# Altium project UF_Servo.PrjPcb (part 4 of 8)

## Sheet Cap_Array_100p_16u.SchDoc: Adjustable Capacitor Bank
size A3; Author: M.Beldyga; CompanyName: WUT ISE; DrawnBy: M.Beldyga; Organization: WUT ISE; Address1: PW ISE; Address2: Nowowiejska 15/19 00-665 Warsaw; Address3: micbeldyga@gmail.com; SheetNumber: 4; SheetTotal: 11; ModifiedBy: -; CheckedDate: -; Title2: 10pF-16uF; DivGrp: WUT ISE; Designer: M.Beldyga; ModifiedDate: -; ProjectName: Sensor Box
Used 2 times, as channels U_PID/U_Cap_Array_100p_16u, U_PID/U_Cap_Array_100p_16u. Parts and nets are listed once, with the designators drawn on the sheet.
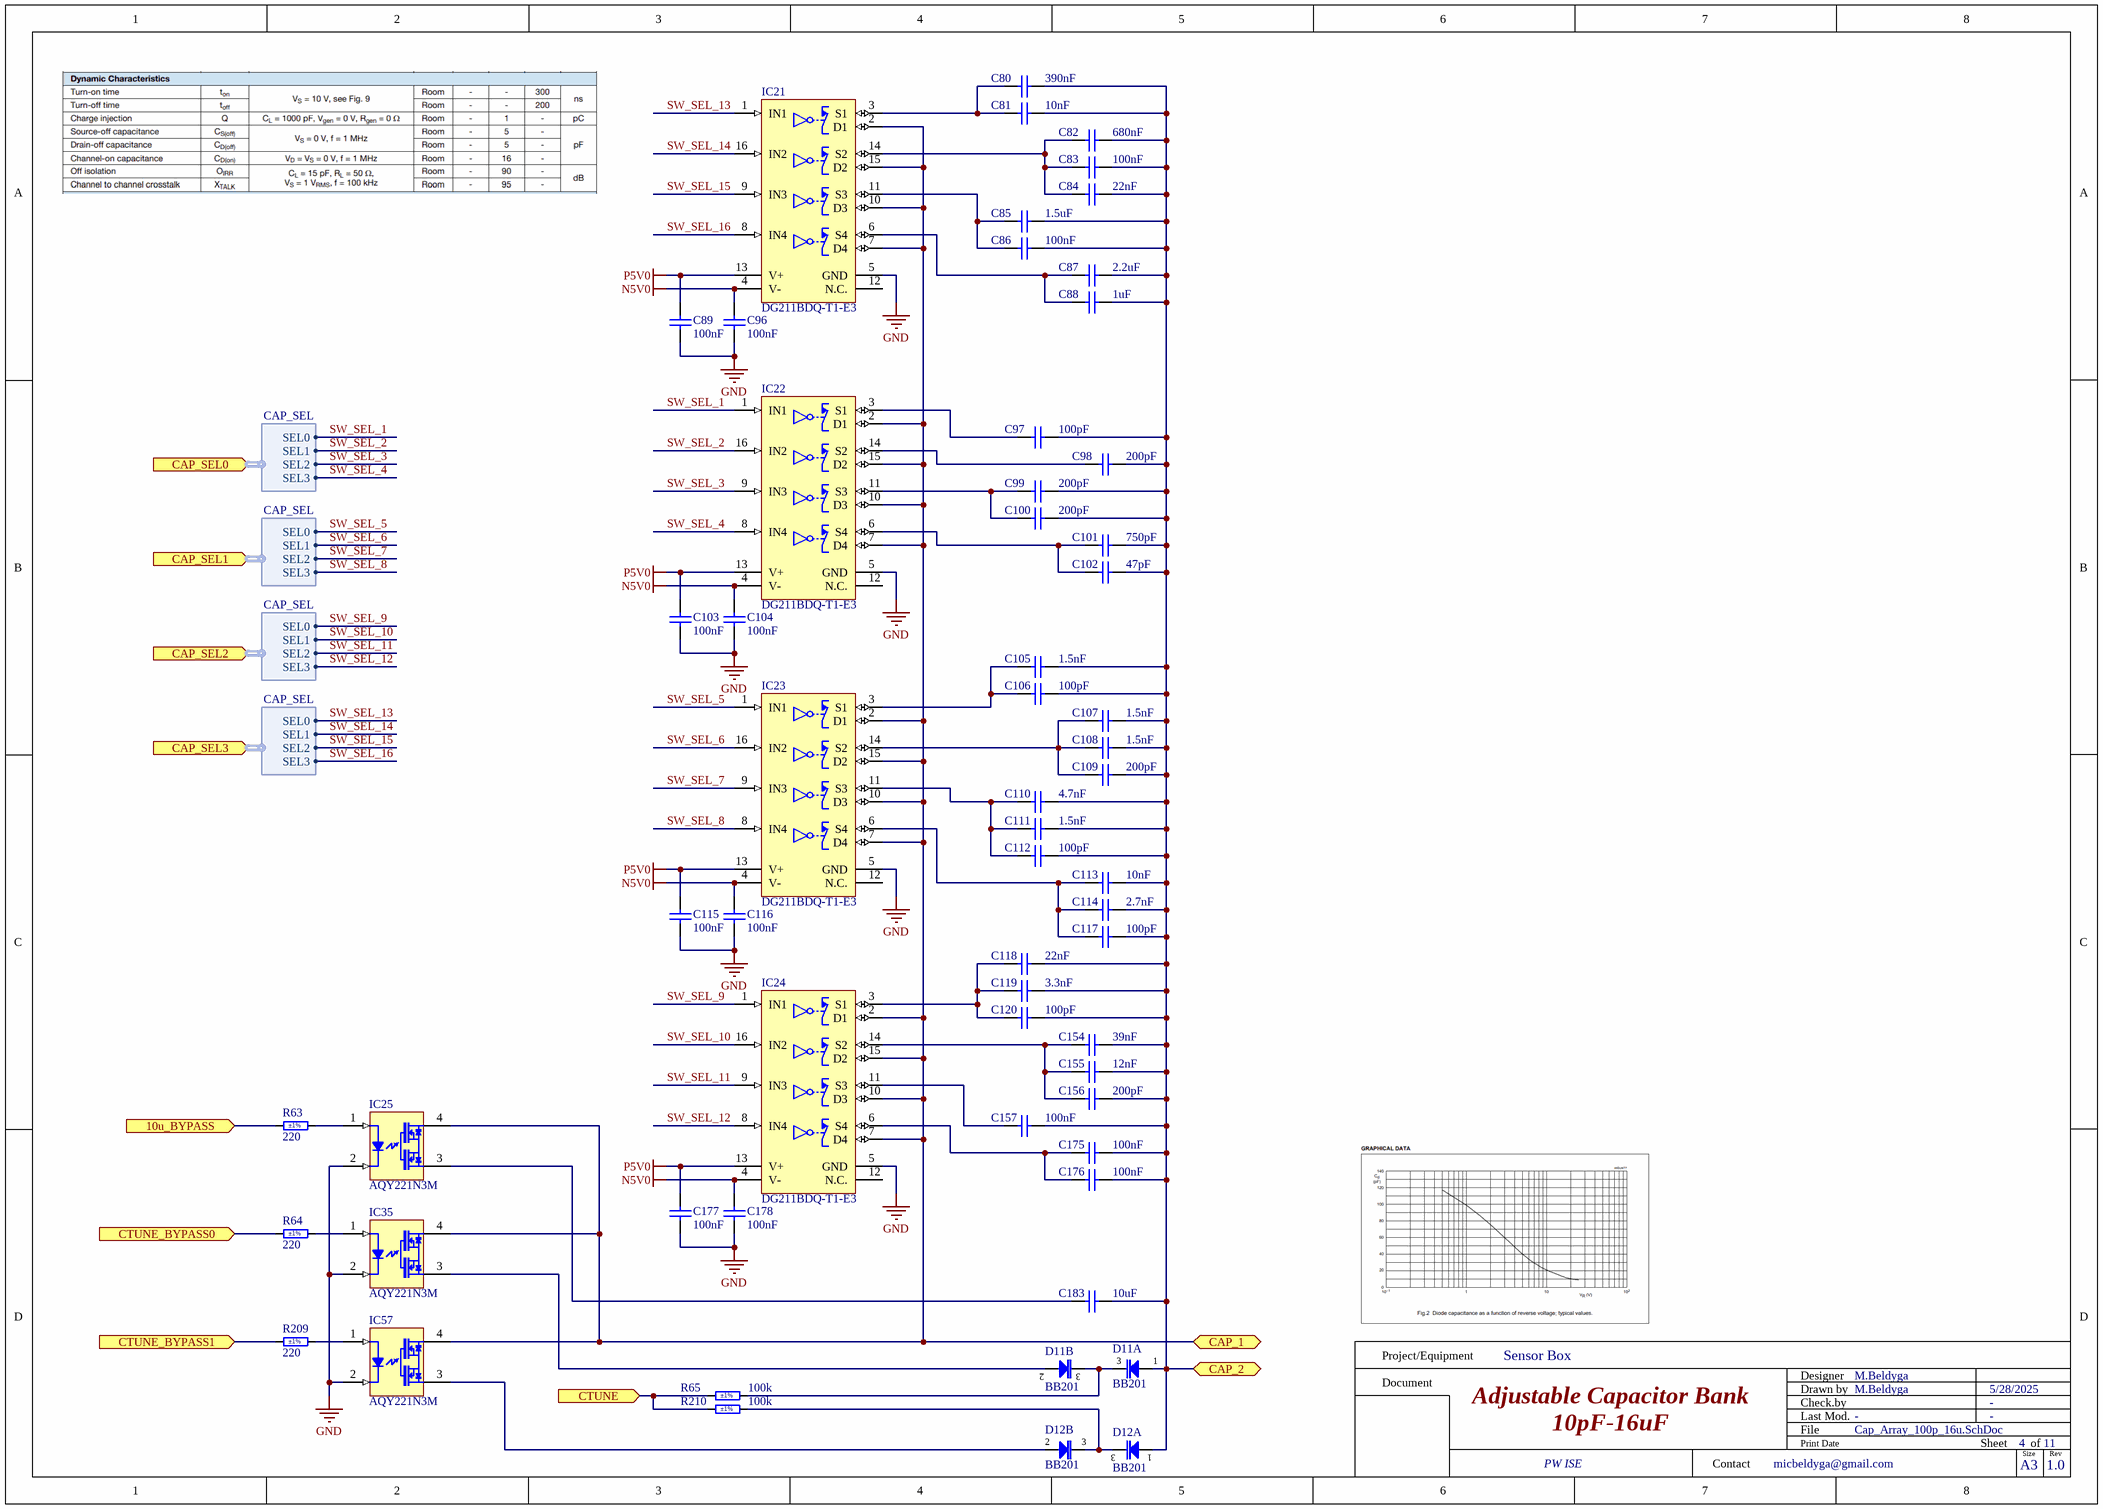
[diagram p4: Cap_Array_100p_16u.SchDoc]

### Parts
C80  390nF  [CAPC1608X90N]
C81  10nF  [CAPC1005X55N]
C82  680nF  [CAPC1608X90N]
C83  100nF  [CAPC1005X55N]
C84  22nF  [CAPC1005X55N]
C85  1.5uF  [CAPC2012X95N]
C86  100nF  [CAPC1005X55N]
C87  2.2uF  [CAPC2012X95N]
C88  1uF  [CAPC1608X90N]
C89  100nF  [CAPC1005X55N]
C96  100nF  [CAPC1005X55N]
C97  100pF  [CAPC1005X55N]
C98  200pF  [CAPC1005X55N]
C99  200pF  [CAPC1005X55N]
C100  200pF  [CAPC1005X55N]
C101  750pF  [CAPC1005X55N]
C102  47pF  [CAPC1005X55N]
C103  100nF  [CAPC1005X55N]
C104  100nF  [CAPC1005X55N]
C105  1.5nF  [CAPC1005X55N]
C106  100pF  [CAPC1005X55N]
C107  1.5nF  [CAPC1005X55N]
C108  1.5nF  [CAPC1005X55N]
C109  200pF  [CAPC1005X55N]
C110  4.7nF  [CAPC1608X90N]
C111  1.5nF  [CAPC1005X55N]
C112  100pF  [CAPC1005X55N]
C113  10nF  [CAPC1608X90N]
C114  2.7nF  [CAPC1608X90N]
C115  100nF  [CAPC1005X55N]
C116  100nF  [CAPC1005X55N]
C117  100pF  [CAPC1005X55N]
C118  22nF  [CAPC2012X95N]
C119  3.3nF  [CAPC1608X90N]
C120  100pF  [CAPC1005X55N]
C154  39nF  [CAPC2012X95N]
C155  12nF  [CAPC1608X90N]
C156  200pF  [CAPC1005X55N]
C157  100nF  [CAPC1810X06N]
C175  100nF  [CAPC1810X06N]
C176  100nF  [CAPC1810X06N]
C177  100nF  [CAPC1005X55N]
C178  100nF  [CAPC1005X55N]
C183  10uF  [CAPC2012X95N]
D11  BB201  [SOT95P230X110-3N]  (parts A,B of 2)
D12  BB201  [SOT95P230X110-3N]  (parts A,B of 2)
IC21  DG211BDQ-T1-E3  [SOP65P640X120-16N]
IC22  DG211BDQ-T1-E3  [SOP65P640X120-16N]
IC23  DG211BDQ-T1-E3  [SOP65P640X120-16N]
IC24  DG211BDQ-T1-E3  [SOP65P640X120-16N]
IC25  AQY221N3M  [PANASONIC_AQY22(SON)]
IC35  AQY221N3M  [PANASONIC_AQY22(SON)]
IC57  AQY221N3M  [PANASONIC_AQY22(SON)]
R63  220  Tolerance: ±1%  [RESC1005X40N]
R64  220  Tolerance: ±1%  [RESC1005X40N]
R65  100k  Tolerance: ±1%  [RESC1005X40N]
R209  220  Tolerance: ±1%  [RESC1005X40N]
R210  100k  Tolerance: ±1%  [RESC1005X40N]

### Ports
10u_BYPASS (in), CAP_1 (bidir), CAP_2 (bidir), CAP_SEL0 (in, harness CAP_SEL), CAP_SEL1 (in, harness CAP_SEL), CAP_SEL2 (in, harness CAP_SEL), CAP_SEL3 (in, harness CAP_SEL), CTUNE (in), CTUNE_BYPASS0 (in), CTUNE_BYPASS1 (in)

### Harnesses
CAP_SEL: SEL0, SEL1, SEL2, SEL3

### Nets
GND: C89.1 C96.1 C103.1 C104.1 C115.1 C116.1 C177.1 C178.1 IC21.5(GND) IC22.5(GND) IC23.5(GND) IC24.5(GND) IC25.2(K) IC35.2(K) IC57.2(K)
N5V0: C96.2 C104.2 C116.2 C178.2 IC21.4(V-) IC22.4(V-) IC23.4(V-) IC24.4(V-)
P5V0: C89.2 C103.2 C115.2 C177.2 IC21.13(V+) IC22.13(V+) IC23.13(V+) IC24.13(V+)
10u_BYPASS: R63.1 ; port 10u_BYPASS
CAP_1: IC21.2(D1) IC21.7(D4) IC21.10(D3) IC21.15(D2) IC22.2(D1) IC22.7(D4) IC22.10(D3) IC22.15(D2) IC23.2(D1) IC23.7(D4) IC23.10(D3) IC23.15(D2) IC24.2(D1) IC24.7(D4) IC24.10(D3) IC24.15(D2) IC25.4(E) IC35.4(E) IC57.4(E) ; port CAP_1
CAP_2: C80.1 C81.2 C82.1 C83.1 C84.2 C85.1 C86.1 C87.1 C88.1 C97.2 C98.1 C99.1 C100.1 C101.1 C102.2 C105.1 C106.2 C107.1 C108.1 C109.1 C110.1 C111.1 C112.2 C113.1 C114.1 C117.2 C118.1 C119.1 C120.2 C154.1 C155.1 C156.1 C157.1 C175.1 C176.1 C183.1 D11.1(A) D12.1(A) ; port CAP_2
CTUNE: R65.2 R210.2 ; port CTUNE
CTUNE_BYPASS0: R64.1 ; port CTUNE_BYPASS0
CTUNE_BYPASS1: R209.1 ; port CTUNE_BYPASS1
SW_SEL_1: IC22.1(IN1) ; port CAP_SEL0.SEL0
SW_SEL_2: IC22.16(IN2) ; port CAP_SEL0.SEL1
SW_SEL_3: IC22.9(IN3) ; port CAP_SEL0.SEL2
SW_SEL_4: IC22.8(IN4) ; port CAP_SEL0.SEL3
SW_SEL_5: IC23.1(IN1) ; port CAP_SEL1.SEL0
SW_SEL_6: IC23.16(IN2) ; port CAP_SEL1.SEL1
SW_SEL_7: IC23.9(IN3) ; port CAP_SEL1.SEL2
SW_SEL_8: IC23.8(IN4) ; port CAP_SEL1.SEL3
SW_SEL_9: IC24.1(IN1) ; port CAP_SEL2.SEL0
SW_SEL_10: IC24.16(IN2) ; port CAP_SEL2.SEL1
SW_SEL_11: IC24.9(IN3) ; port CAP_SEL2.SEL2
SW_SEL_12: IC24.8(IN4) ; port CAP_SEL2.SEL3
SW_SEL_13: IC21.1(IN1) ; port CAP_SEL3.SEL0
SW_SEL_14: IC21.16(IN2) ; port CAP_SEL3.SEL1
SW_SEL_15: IC21.9(IN3) ; port CAP_SEL3.SEL2
SW_SEL_16: IC21.8(IN4) ; port CAP_SEL3.SEL3
NetC80_2: C80.2 C81.1 IC21.3(S1)
NetC82_2: C82.2 C83.2 C84.1 IC21.14(S2)
NetC85_2: C85.2 C86.2 IC21.11(S3)
NetC87_2: C87.2 C88.2 IC21.6(S4)
NetC97_1: C97.1 IC22.3(S1)
NetC98_2: C98.2 IC22.14(S2)
NetC99_2: C99.2 C100.2 IC22.11(S3)
NetC101_2: C101.2 C102.1 IC22.6(S4)
NetC105_2: C105.2 C106.1 IC23.3(S1)
NetC107_2: C107.2 C108.2 C109.2 IC23.14(S2)
NetC110_2: C110.2 C111.2 C112.1 IC23.11(S3)
NetC113_2: C113.2 C114.2 C117.1 IC23.6(S4)
NetC118_2: C118.2 C119.2 C120.1 IC24.3(S1)
NetC154_2: C154.2 C155.2 C156.2 IC24.14(S2)
NetC157_2: C157.2 IC24.11(S3)
NetC175_2: C175.2 C176.2 IC24.6(S4)
NetC183_2: C183.2 IC25.3(C)
NetD11_2: D11.2(A) IC35.3(C)
NetD11_3: D11.3(COMC) R65.1
NetD12_2: D12.2(A) IC57.3(C)
NetD12_3: D12.3(COMC) R210.1
NetIC25_1: IC25.1(A) R63.2
NetIC35_1: IC35.1(A) R64.2
NetIC57_1: IC57.1(A) R209.2

Not connected (* = marked no-connect by the designer): IC21 12(N.C.); IC22 12(N.C.); IC23 12(N.C.); IC24 12(N.C.)

### Channels
U_PID/U_Cap_Array_100p_16u: designators end in B; ports 10u_BYPASS=EXP0_P14 CAP_1=NetIC21B_2 CAP_2=NetC10B_2 CTUNE=DAC_VOUT4 CTUNE_BYPASS0=EXP0_P9 CTUNE_BYPASS1=EXP0_P4
U_PID/U_Cap_Array_100p_16u: designators end in A; ports 10u_BYPASS=EXP3_P21 CAP_1=NetIC21A_2 CAP_2=NetC10A_2 CTUNE=DAC_VOUT11 CTUNE_BYPASS0=EXP3_P20 CTUNE_BYPASS1=EXP3_P19

### Notes on the sheet
- Project/Equipment
- Document
- Designer
- Drawn by
- Check.by
- Contact
- File
- Last Mod.
- Print Date
- Sheet
- Size
- A3
- of
- Rev

### Library data of the parts
C80 = 0603 390nF 16V: Cap Ceramic 0.39uF 16V X7R 5% Pad SMD 0603 125C T/R; Manufacturer: KEMET; Manufacturer Part Number: C0603C394J4RACTU; Temperature Coefficient: 30ppm/°C; Supplier: Mouser; Supplier Part Number: 80-C0603C394J4R; RoHS: Yes; Category: Ceramic Capacitors; Stock: 11668; Pricing: 1=0.36, 10=0.213, 50=0.213, 100=0.14, 1000=0.102, 10000=0.077 (USD); Case/Package: 0603; Dielectric Material: Ceramic; Material: Ceramic; Case Code (Imperial): 0603; Case Code (Metric): 1608; Min Operating Temperature: -55°C; Max Operating Temperature: 125°C; Value: 390nF; Tolerance: 5%; Voltage Rating: 16V; Voltage Rating (DC): 16V; Termination: SMD/SMT; Packaging: Tape and Reel; Package Quantity: 4000; Series: C0603C; Height: 870um; RoHS Compliant: Yes; ComponentLink1URL: http://www.mouser.com/ds/2/212/KEM_C1002_X7R_SMD-1102033.pdf?src-supplier=Mouser; ComponentLink1Description: http://www.mouser.com/ds/2/212/KEM_C1002_X7R_SMD-1102033.pdf?src-supplier=Mouser; ComponentLink2URL: https://datasheet.octopart.com/C0603C394J4RACTU-KEMET-datasheet-130256537.pdf?src-supplier=Farnell; ComponentLink2Description: https://datasheet.octopart.com/C0603C394J4RACTU-KEMET-datasheet-130256537.pdf?src-supplier=Farnell; ComponentLink3URL: https://datasheet.octopart.com/C0603C394J4RACTU-KEMET-datasheet-175422952.pdf?src-supplier=Newark; ComponentLink3Description: https://datasheet.octopart.com/C0603C394J4RACTU-KEMET-datasheet-175422952.pdf?src-supplier=Newark; ComponentLink4URL: https://datasheet.octopart.com/C0603C394J4RACTU-KEMET-datasheet-157246124.pdf?src-supplier=Electro+Sonic; ComponentLink4Description: https://datasheet.octopart.com/C0603C394J4RACTU-KEMET-datasheet-157246124.pdf?src-supplier=Electro+Sonic
C81 = CC0402_10NF_16V_10%_X7R: Non-polarised capacitor; Part Description: SMD Multilayer Chip Ceramic Capacitor; Manufacturer: GENERIC; Manufacturer1 Part Number: 223878715636; Voltage: 16V; TC: X7R; Tolerance: ±10%; Part Number: CC0402_10NF_16V_10%_X7R; Component Kind: Standard; Component Type: Standard; Pin Count: 2; Value: 10nF; Status: Not Recommended; Manufacturer Part Number: CC0402_10NF_16V_10%_X7R; Case: 0402; Mounted: Yes; Socket: No; SMD: Yes; Sense: No; Manufacturer1 Example: PHYCOMP; Manufacturer1 ComponentHeight: 0.55mm; HelpURL: \\cern.ch\dfs\Applications\Altium\Datasheets\CC0402_X7R_PHYCOMP.pdf; Author: CERN DEM JLC; CreateDate: 12/3/2007; LatestRevisionDate: 12/3/2007
C82 = 0603 680nF 16V: Surface Mount Ceramic Multilayer Capacitor 0.68uF 5% X7R 16V 0603 Paper T/R; Manufacturer: Yageo; Manufacturer Part Number: CC0603JRX7R7BB684; Supplier: Digikey; Supplier Part Number: 13-CC0603JRX7R7BB684CT-ND; RoHS: No; Category: Ceramic Capacitors; Stock: 8893; Pricing: 1=0.15, 10=0.086, 100=0.0527, 1000=0.03562 (USD); Case/Package: 0603; Value: 680nF; Dielectric: X7R; Voltage Rating (DC): 16V; Halogen Free: Halogen Free; Lead Free: Lead Free
C83 C86 C89 C96 C103 C104 C115 C116 C177 C178 = CC0402_100NF_50V_10%_X7R: as C4 on sheet PID; Part Number: CC0402_100NF_50V_10%_X7R; Component Kind: Standard; Component Type: Standard; Pin Count: 2; Value: 100nF; Status: None; Manufacturer Part Number: CC0402_100NF_50V_10%_X7R; Case: 0402; Mounted: Yes; Socket: No; SMD: Yes; Sense: No; Manufacturer1 Example: MURATA; Manufacturer1 ComponentHeight: 0.55mm; HelpURL: \\cern.ch\dfs\Applications\Altium\Datasheets\CC0402_MURATA_GRM155R71H104KE14D.pdf; Author: CERN DEM MR; CreateDate: 6/30/2017; LatestRevisionDate: 6/30/2017
C84 = CC0402_22NF_50V_5%_X7R: Non-polarised capacitor; Part Description: SMD Multilayer Chip Ceramic Capacitor; Manufacturer: GENERIC; Manufacturer1 Part Number: C0402C223J5RAC; Voltage: 50V; TC: X7R; Tolerance: ±5%; Part Number: CC0402_22NF_50V_5%_X7R; Component Kind: Standard; Component Type: Standard; Pin Count: 2; Value: 22nF; Status: Preferred; Manufacturer Part Number: CC0402_22NF_50V_5%_X7R; Case: 0402; Mounted: Yes; Socket: No; SMD: Yes; Sense: No; Manufacturer1 Example: KEMET; Manufacturer1 ComponentHeight: 0.55mm; HelpURL: \\cern.ch\dfs\Applications\Altium\Datasheets\CC0402_X7R_KEMET.pdf; Author: CERN DEM BC; CreateDate: 7/15/2020; LatestRevisionDate: 7/15/2020
C85 = 0805 1.5uF 16V: Multilayer Ceramic Capacitors MLCC - SMD/SMT 16V 1.5uF X7R 0805 5% AEC-Q200; Manufacturer: KEMET; Manufacturer Part Number: C0805C155J4RECAUTO; Supplier: Mouser; Supplier Part Number: 80-C0805C155J4RECAUT; RoHS: Yes; Category: Ceramic Capacitors; Stock: 6068; Pricing: 1=0.3, 10=0.178, 50=0.178, 100=0.115, 1000=0.083, 10000=0.062 (USD); RoHS Compliant: Yes; ComponentLink1URL: https://api.kemet.com/component-edge/download/datasheet/C0805C155J4RECAUTO.pdf?src-supplier=Digikey; ComponentLink1Description: https://api.kemet.com/component-edge/download/datasheet/C0805C155J4RECAUTO.pdf?src-supplier=Digikey
C87 = 0805 2.2uF 16V: Multilayer Ceramic Capacitors MLCC - SMD/SMT 16V 2.2uF X7R 0805 5%View Simulation and SPICE Model in K-SIM; Manufacturer: KEMET; Manufacturer Part Number: C0805C225J4RECTU; Supplier: Mouser; Supplier Part Number: 80-C0805C225J4RECTU; RoHS: Yes; Category: LDO; Stock: 3475; Pricing: 1=0.27, 10=0.161, 50=0.161, 100=0.103, 1000=0.074, 10000=0.055 (USD); RoHS Compliant: Yes; ComponentLink1URL: https://datasheet.octopart.com/C0805C225J4RECTU-KEMET-datasheet-153706760.pdf?src-supplier=Farnell; ComponentLink1Description: https://datasheet.octopart.com/C0805C225J4RECTU-KEMET-datasheet-153706760.pdf?src-supplier=Farnell
C88 = 0603 1uF 16V: SMD Multilayer Ceramic Capacitor, 1 ï¿½F, 16 V, 0603 [1608 Metric], ï¿½ 5%, X7R; Manufacturer: Yageo; Manufacturer Part Number: CC0603JRX7R7BB105; Voltage Rating (DC): 16V; Supplier: Digikey; Supplier Part Number: 311-3485-1-ND; RoHS: Yes; Category: Ceramic Capacitors; Stock: 7141; Pricing: 1=0.2, 10=0.116, 100=0.0639, 1000=0.04383 (USD); Mounting Technology: Surface Mount; Case/Package: 0603; Case Code (Imperial): 0603; Case Code (Metric): 1608; Min Operating Temperature: -55°C; Max Operating Temperature: 125°C; Value: 1uF; Dielectric: X7R; Packaging: Cut Tape; Tolerance: 5%; Voltage Rating: 16V; Series: CC; Lead Free: Lead Free; Halogen Free: 5694HalogenFree; ComponentLink1URL: http://www.yageo.com/documents/recent/UPY-GPHC_X7R_6.3V-to-50V_18.pdf?src-supplier=Digikey; ComponentLink1Description: http://www.yageo.com/documents/recent/UPY-GPHC_X7R_6.3V-to-50V_18.pdf?src-supplier=Digikey; ComponentLink2URL: https://www.yageo.com/upload/media/product/productsearch/datasheet/mlcc/UPY-GPHC_X7R_6.3V-to-50V_18.pdf?src-supplier=Digikey; ComponentLink2Description: https://www.yageo.com/upload/media/product/productsearch/datasheet/mlcc/UPY-GPHC_X7R_6.3V-to-50V_18.pdf?src-supplier=Digikey; ComponentLink3URL: https://datasheet.octopart.com/CC0603JRX7R7BB105-Yageo-datasheet-151948686.pdf?src-supplier=Farnell; ComponentLink3Description: https://datasheet.octopart.com/CC0603JRX7R7BB105-Yageo-datasheet-151948686.pdf?src-supplier=Farnell; ComponentLink4URL: https://datasheet.octopart.com/CC0603JRX7R7BB105-Yageo-datasheet-166511530.pdf?src-supplier=Future+Electronics; ComponentLink4Description: https://datasheet.octopart.com/CC0603JRX7R7BB105-Yageo-datasheet-166511530.pdf?src-supplier=Future+Electronics; ComponentLink5URL: https://datasheet.octopart.com/CC0603JRX7R7BB105-Yageo-datasheet-147453679.pdf?src-supplier=Newark; ComponentLink5Description: https://datasheet.octopart.com/CC0603JRX7R7BB105-Yageo-datasheet-147453679.pdf?src-supplier=Newark
C97 C106 C112 C117 C120 = CC0402_100PF_25V_1%_C0G: Non-polarised capacitor; Part Description: SMD Multilayer Chip Ceramic Capacitor; Manufacturer: GENERIC; Manufacturer1 Part Number: CBR04C101F3GAC; Voltage: 25V; TC: C0G/NP0; Tolerance: ±1%; Part Number: CC0402_100PF_25V_1%_C0G; Component Kind: Standard; Component Type: Standard; Pin Count: 2; Value: 100pF; Status: Not Recommended; Manufacturer Part Number: CC0402_100PF_25V_1%_C0G; Case: 0402; Mounted: Yes; Socket: No; SMD: Yes; Sense: No; Manufacturer1 Example: KEMET; Manufacturer1 ComponentHeight: 0.55mm; HelpURL: \\cern.ch\dfs\Applications\Altium\Datasheets\CC0402_C0G_KEMET_HiQ-CBR.pdf; Author: CERN DEM HF; CreateDate: 10/20/2022; LatestRevisionDate: 10/20/2022
C98-C100 C109 C156 = 0402 200pF 50V: Multilayer Ceramic Capacitor, 200 pF, 50 V, ï¿½ 1%, C0G (NP0), 0402 [1005 Metric]; Manufacturer: Murata; Manufacturer Part Number: GCM1555C1H201FA16D; Material: 4241ConductorMaterial; Temperature Coefficient: 30ppm/°C; Voltage Rating: 50V; Supplier: Mouser; Supplier Part Number: 81-GCM1555C1H201FA6D; RoHS: Yes; Category: Ceramic Capacitors; Stock: 21118; Pricing: 1=0.1, 10=0.035, 50=0.035, 100=0.021, 1000=0.016, 10000=0.009 (USD); Case/Package: 343Case; Min Operating Temperature: -55°C; Max Operating Temperature: 125°C; Value: 200pF; Length: 1mm; Width: 500um; Height: 550um; Thickness: 500um; RoHS Compliant: Yes; ComponentLink1URL: https://datasheet.octopart.com/GCM1555C1H201FA16D-Murata-datasheet-12511495.pdf?src-supplier=TME; ComponentLink1Description: https://datasheet.octopart.com/GCM1555C1H201FA16D-Murata-datasheet-12511495.pdf?src-supplier=TME
C101 = 0402 750pF 50V: Cap Auto-grade 750PF 50VDC C0G 1% SMD 0402; Manufacturer: Murata; Manufacturer Part Number: GCM1555C1H751FA16D; Supplier: Mouser; Supplier Part Number: 81-GCM1555C1H751FA6D; RoHS: Yes; Category: Ceramic Capacitors; Stock: 21110; Pricing: 1=0.1, 10=0.04, 50=0.04, 100=0.024, 1000=0.017, 10000=0.01 (USD); RoHS Compliant: Yes
C102 = CC0402_47PF_50V_1%_C0G_MURATA_GJM1555C1H470FB01D: Non-polarised capacitor; Part Description: High-Q SMD Chip Monolithic Ceramic Capacitor; Manufacturer: MURATA; Voltage: 50V; TC: C0G/NP0; Tolerance: ±1%; Part Number: CC0402_47PF_50V_1%_C0G_MURATA_GJM1555C1H470FB01D; Component Kind: Standard; Component Type: Standard; Pin Count: 2; Value: 47pF; Status: None; Manufacturer Part Number: GJM1555C1H470FB01; Case: 0402; Mounted: Yes; Socket: No; SMD: Yes; Sense: No; ComponentHeight: 0.55mm; HelpURL: \\cern.ch\dfs\Applications\Altium\Datasheets\CC0402_MURATA_GJM1555C1H470FB01D.pdf; Author: CERN DEM BC; CreateDate: 11/20/2017; LatestRevisionDate: 11/20/2017
C105 C107 C108 C111 = 0402 1.5nF 50V: ESD SMD Auto C0G 0402 (1005Metric) Ceramic Capacitor 0.039Lx0.020W 1.00mmx0.50mm C0G NP0 ±1% 1500pF; Manufacturer: KEMET; Manufacturer Part Number: C0402C152F5GECAUTO; Supplier: Mouser; Supplier Part Number: 80-C0402C152F5GECAUT; RoHS: Yes; Category: Ceramic Capacitors; Stock: 2168; Pricing: 1=0.59, 10=0.367, 50=0.367, 100=0.251, 1000=0.19, 10000=0.151 (USD); RoHS Compliant: Yes; ComponentLink1URL: https://datasheet.octopart.com/C0402C152F5GECAUTO-KEMET-datasheet-154276015.pdf?src-supplier=Farnell; ComponentLink1Description: https://datasheet.octopart.com/C0402C152F5GECAUTO-KEMET-datasheet-154276015.pdf?src-supplier=Farnell; ComponentLink2URL: https://api.kemet.com/component-edge/download/datasheet/C0402C152F5GECAUTO.pdf?src-supplier=Digikey; ComponentLink2Description: https://api.kemet.com/component-edge/download/datasheet/C0402C152F5GECAUTO.pdf?src-supplier=Digikey; ComponentLink3URL: https://datasheet.octopart.com/C0402C152F5GECAUTO-KEMET-datasheet-185374772.pdf?src-supplier=Newark; ComponentLink3Description: https://datasheet.octopart.com/C0402C152F5GECAUTO-KEMET-datasheet-185374772.pdf?src-supplier=Newark
C110 = 0603 4.7nF 50V: Cap Ceramic 0.0047uF 50V C0G 1% Pad SMD 0603 125°C Automotive T/R; Manufacturer: Murata; Manufacturer Part Number: GCM1885C1H472FA16D; Temperature Coefficient: 30ppm/°C; Supplier: Mouser; Supplier Part Number: 81-GCM1885C1H472FA6D; RoHS: Yes; Category: Ceramic Capacitors; Stock: 7633; Pricing: 1=0.18, 10=0.102, 50=0.102, 100=0.064, 1000=0.044, 10000=0.03 (USD); Case/Package: 0603; Material: Ceramic; Min Operating Temperature: -55°C; Max Operating Temperature: 125°C; Value: 4.7nF; Tolerance: 1%; Voltage Rating: 50V; Length: 1.6mm; Width: 800um; Height: 900um; Thickness: 800um
C113 = 0603 10nF 25V: Multilayer Ceramic Capacitors MLCC - SMD/SMT 25V 0.01uF C0G 0603 1% AEC-Q200; Manufacturer: KEMET; Manufacturer Part Number: C0603C103F3GECAUTO; Supplier: Mouser; Supplier Part Number: 80-C0603C103F3GEAUTO; RoHS: Yes; Category: Ceramic Capacitors; Stock: 14714; Pricing: 1=0.8, 10=0.507, 50=0.507, 100=0.354, 1000=0.284, 10000=0.239 (USD); Value: 10nF; Voltage Rating (DC): 25V; RoHS Compliant: Yes; ComponentLink1URL: https://datasheet.octopart.com/C0603C103F3GECAUTO-KEMET-datasheet-149521794.pdf?src-supplier=Farnell; ComponentLink1Description: https://datasheet.octopart.com/C0603C103F3GECAUTO-KEMET-datasheet-149521794.pdf?src-supplier=Farnell
C114 = 0603 2.7nF 50V: Powerrain/Safety for Automotive AEC-Q200 Up to 125C Reflow soldering Flow soldering; Manufacturer: Murata; Manufacturer Part Number: GCM1885C1H272FA16J; Supplier: Mouser; Supplier Part Number: 81-GCM1885C1H272FA6J; RoHS: Yes; Category: Ceramic Capacitors; Stock: 14497; Pricing: 1=0.17, 10=0.098, 50=0.098, 100=0.061, 1000=0.042, 10000=0.029 (USD); RoHS Compliant: Yes
C118 = 0805 22nF 50V: 0805 50V C0G 0.022uF 1% Automotive grade multilayer ceramic capacitor; Manufacturer: Murata; Manufacturer Part Number: GCM21B5C1H223FA16L; Supplier: Mouser; Supplier Part Number: 81-GCM21B5C1H223FA6L; RoHS: Yes; Category: Ceramic Capacitors; Stock: 27751; Pricing: 1=0.53, 10=0.326, 50=0.326, 100=0.221, 1000=0.168, 10000=0.127 (USD); RoHS Compliant: Yes; ComponentLink1URL: https://datasheet.octopart.com/GCM21B5C1H223FA16L-Murata-datasheet-155238815.pdf?src-supplier=Farnell; ComponentLink1Description: https://datasheet.octopart.com/GCM21B5C1H223FA16L-Murata-datasheet-155238815.pdf?src-supplier=Farnell; ComponentLink2URL: https://datasheet.octopart.com/GCM21B5C1H223FA16L-Murata-datasheet-12511495.pdf?src-supplier=TME; ComponentLink2Description: https://datasheet.octopart.com/GCM21B5C1H223FA16L-Murata-datasheet-12511495.pdf?src-supplier=TME
C119 = 0603 3.3nF 50V: Cap Ceramic 0.0033uF 50V C0G 1% Pad SMD 0603 125°C Automotive T/R; Manufacturer: Murata; Manufacturer Part Number: GCM1885C1H332FA16D; Temperature Coefficient: 30ppm/°C; Supplier: Mouser; Supplier Part Number: 81-GCM1885C1H332FA6D; RoHS: Yes; Category: Ceramic Capacitors; Stock: 4669; Pricing: 1=0.17, 10=0.096, 50=0.096, 100=0.06, 1000=0.041, 10000=0.029 (USD); Case/Package: 0603; Material: Ceramic; Min Operating Temperature: -55°C; Max Operating Temperature: 125°C; Value: 3.3nF; Tolerance: 1%; Voltage Rating: 50V; Length: 1.6mm; Width: 800um; Height: 900um; Thickness: 800um; RoHS Compliant: Yes; ComponentLink1URL: https://datasheet.octopart.com/GCM1885C1H332FA16D-Murata-datasheet-12511495.pdf?src-supplier=TME; ComponentLink1Description: https://datasheet.octopart.com/GCM1885C1H332FA16D-Murata-datasheet-12511495.pdf?src-supplier=TME
C154 = 0805 39nF 100V: Multilayer Ceramic Capacitors MLCC - SMD/SMT 0805 C0G 39000pF 2% 100VDC; Manufacturer: Murata; Manufacturer Part Number: GRM2195C2A393GE01J; Voltage Rating (DC): 100V; Supplier: Mouser; Supplier Part Number: 81-GRM2195C2A393GE1J; RoHS: No; Category: Ceramic Capacitors; Stock: 9963; Pricing: 1=0.43, 10=0.259, 50=0.259, 100=0.172, 500=0.16, 1000=0.127, 2500=0.109, 10000=0.098, 20000=0.096, 50000=0.093 (USD); Case/Package: 0805; Value: 39nF; Length: 2mm; Width: 1.25mm; Thickness: 850um; ComponentLink1URL: https://datasheet.octopart.com/GRM2195C2A393GE01J-Murata-datasheet-165579666.pdf?src-supplier=TME; ComponentLink1Description: https://datasheet.octopart.com/GRM2195C2A393GE01J-Murata-datasheet-165579666.pdf?src-supplier=TME
C155 = 0603 12nF 25V: Cap Ceramic 0.012uF 25V C0G 1% Pad SMD 0603 125°C Extreme Low ESR T/R; Manufacturer: KEMET; Manufacturer Part Number: C0603C123F3GACTU; Temperature Coefficient: 30ppm/°C; Supplier: Mouser; Supplier Part Number: 80-C0603C123F3G; RoHS: Yes; Category: Ceramic Capacitors; Stock: 7993; Pricing: 1=1.6, 10=1.07, 50=1.07, 100=0.752, 1000=0.622, 10000=0.509 (USD); Case/Package: 0603; Case Code (Imperial): 0603; Case Code (Metric): 1608; Dielectric Material: Ceramic; Material: Ceramic; Min Operating Temperature: -55°C; Max Operating Temperature: 125°C; Value: 12nF; Packaging: Tape and Reel; Package Quantity: 4000; Tolerance: 1%; Voltage Rating: 25V; Voltage Rating (DC): 25V; Termination: SMD/SMT; Series: C0603C; Height: 870um; Lead Free: Lead Free; RoHS Compliant: Yes; ComponentLink1URL: http://www.mouser.com/ds/2/212/KEM_C1003_C0G_SMD-1101588.pdf?src-supplier=Mouser; ComponentLink1Description: http://www.mouser.com/ds/2/212/KEM_C1003_C0G_SMD-1101588.pdf?src-supplier=Mouser; ComponentLink2URL: https://datasheet.octopart.com/C0603C123F3GACTU-KEMET-datasheet-68331921.pdf?src-supplier=Farnell; ComponentLink2Description: https://datasheet.octopart.com/C0603C123F3GACTU-KEMET-datasheet-68331921.pdf?src-supplier=Farnell; ComponentLink3URL: https://datasheet.octopart.com/C0603C123F3GACTU-KEMET-datasheet-178088019.pdf?src-supplier=Element14; ComponentLink3Description: https://datasheet.octopart.com/C0603C123F3GACTU-KEMET-datasheet-178088019.pdf?src-supplier=Element14; ComponentLink4URL: https://datasheet.octopart.com/C0603C123F3GACTU-KEMET-datasheet-170576060.pdf?src-supplier=Newark; ComponentLink4Description: https://datasheet.octopart.com/C0603C123F3GACTU-KEMET-datasheet-170576060.pdf?src-supplier=Newark; ComponentLink5URL: https://datasheet.octopart.com/C0603C123F3GACTU-KEMET-datasheet-157246123.pdf?src-supplier=Electro+Sonic; ComponentLink5Description: https://datasheet.octopart.com/C0603C123F3GACTU-KEMET-datasheet-157246123.pdf?src-supplier=Electro+Sonic
C157 C175 C176 = 0704 100nF 50V: Cap Cer 0.1UF 50V C0G/NP0 0704; Manufacturer: Murata; Manufacturer Part Number: GRMJN65C1H104GE01J; Material: 4241ConductorMaterial; Temperature Coefficient: 30ppm/°C; Tolerance: 2%; Supplier: Mouser; Supplier Part Number: 81-GRMJN65C1H104GE1J; RoHS: No; Stock: 3204; Pricing: 1=0.52, 10=0.317, 50=0.317, 100=0.211, 1000=0.175, 10000=0.126 (USD); Case/Package: 705Case; Min Operating Temperature: -55°C; Max Operating Temperature: 125°C; Value: 100nF; Voltage Rating: 50V; Height: 650um
C183 = 0805 10uF 16V: Multilayer Ceramic Capacitors MLCC - SMD/SMT 10V 10uF X7R 0805 5% AEC-Q200; Manufacturer: KEMET; Manufacturer Part Number: C0805C106J8RACAUTO; Supplier: Digikey; Supplier Part Number: 399-15693-1-ND; RoHS: Yes; Category: Ceramic Capacitors; Stock: 9106; Pricing: 1=0.88, 10=0.556, 100=0.3912, 1000=0.30524 (USD); Mounting Technology: Surface Mount; Case/Package: 0805; Dielectric Material: Ceramic; Case Code (Imperial): 0805; Case Code (Metric): 2012; Material: Ceramic; Min Operating Temperature: -55°C; Max Operating Temperature: 125°C; Packaging: Cut Tape; Value: 10uF; Tolerance: 5%; Voltage Rating: 10V; Series: SMD Auto X7R; Dielectric: X7R; Voltage Rating (DC): 10V; Height: 1.45mm; Ratings: AEC-Q200; RoHS Compliant: Yes; ComponentLink1URL: http://www.farnell.com/datasheets/2741399.pdf?src-supplier=Farnell; ComponentLink1Description: http://www.farnell.com/datasheets/2741399.pdf?src-supplier=Farnell; ComponentLink2URL: http://www.farnell.com/datasheets/2741399.pdf?src-supplier=Element14; ComponentLink2Description: http://www.farnell.com/datasheets/2741399.pdf?src-supplier=Element14; ComponentLink3URL: https://datasheet.octopart.com/C0805C106J8RACAUTO-KEMET-datasheet-149523940.pdf?src-supplier=Farnell; ComponentLink3Description: https://datasheet.octopart.com/C0805C106J8RACAUTO-KEMET-datasheet-149523940.pdf?src-supplier=Farnell; ComponentLink4URL: https://api.kemet.com/component-edge/download/datasheet/C0805C106J8RACAUTO.pdf?src-supplier=Digikey; ComponentLink4Description: https://api.kemet.com/component-edge/download/datasheet/C0805C106J8RACAUTO.pdf?src-supplier=Digikey; ComponentLink5URL: http://www.farnell.com/datasheets/2741399.pdf?src-supplier=Newark; ComponentLink5Description: http://www.farnell.com/datasheets/2741399.pdf?src-supplier=Newark; ComponentLink6URL: https://datasheet.octopart.com/C0805C106J8RACAUTO-KEMET-datasheet-181957623.pdf?src-supplier=Newark; ComponentLink6Description: https://datasheet.octopart.com/C0805C106J8RACAUTO-KEMET-datasheet-181957623.pdf?src-supplier=Newark; ComponentLink7URL: https://datasheet.octopart.com/C0805C106J8RACAUTO-KEMET-datasheet-137036859.pdf?src-supplier=TME; ComponentLink7Description: https://datasheet.octopart.com/C0805C106J8RACAUTO-KEMET-datasheet-137036859.pdf?src-supplier=TME
D11 D12 = BB201: Dual Common Cathode Varicap Diodes; Part Description: Dual Common Cathode Low-voltage Variable Capacitance Diode; Manufacturer: NXP SEMICONDUCTORS; Voltage: 15V; Power: 20mA; PressFit: No; Bonding: No; Part Number: BB201; Component Kind: Standard; Component Type: Standard; Device: BB201; PackageDescription: SOT, 0.95mm Pitch; 3 Pin, 1.30mm W X 2.90mm L X 1.10mm H body, IPC Medium Density; Manufacturer Part Number: BB201; Pin Count: 3; Case: SOT23-3; Mounted: Yes; Socket: No; SMD: Yes; Sense: No; ComponentHeight: 1.1mm; HelpURL: \\cern.ch\dfs\Applications\Altium\Datasheets\BB201.pdf; Author: CERN DEM JLC; CreateDate: 12/16/2013; LatestRevisionDate: 12/16/2013
IC21-IC24 = DG211BDQ-T1-E3: DG211B Series SPST 22 V 50 Ohm Surface Mount Improved Analog Switch - TSSOP-16; Manufacturer: Vishay Siliconix; Number of Channels: 4; Max Supply Voltage: 25V; Min Supply Voltage: 4.5V; Max Dual Supply Voltage: 22V; Max Power Dissipation: 640mW; Max Supply Current: 10uA; Supply Type: Single,Dual; Supply Current: 50uA; Supplier: Digikey; Supplier Part Number: DG211BDQ-T1-E3CT-ND; Manufacturer Part Number: DG211BDQ-T1-E3; RoHS: Yes; Category: Decoders and Multiplexers; Stock: 12512; Pricing: 1=2.28, 10=1.689, 25=1.5416, 100=1.3792, 250=1.30176, 500=1.2551, 1000=1.2167 (USD); Mounting Technology: Surface Mount; Case/Package: TSSOP; Pins: 16; Weight: 0.006102oz; Min Operating Temperature: -40°C; Max Operating Temperature: 85°C; Package Quantity: 3000; Packaging: Tape and Reel; Number of Inputs: 4; Number of Outputs: 4; Min Dual Supply Voltage: 4.5V; Power Dissipation: 640mW; Throw Configuration: SPST; Series: -; Number of Circuits: 4; Length: 5.08mm; Width: 4.4mm; Height: 0.92mm; Radiation Hardening: No; Lead Free: Lead Free; RoHS Compliant: Yes; Reach SVHC Compliant: Unknown; ComponentLink1URL: https://datasheet.ciiva.com/26911/getdatasheetpartid-399112-26911024.pdf?src-supplier=Verical; ComponentLink1Description: https://datasheet.ciiva.com/26911/getdatasheetpartid-399112-26911024.pdf?src-supplier=Verical; ComponentLink2URL: https://datasheet.ciiva.com/23943/1759079-23943571.pdf?src-supplier=Newark; ComponentLink2Description: https://datasheet.ciiva.com/23943/1759079-23943571.pdf?src-supplier=Newark; ComponentLink3URL: https://datasheet.ciiva.com/6639/70040-6639199.pdf?src-supplier=Digikey; ComponentLink3Description: https://datasheet.ciiva.com/6639/70040-6639199.pdf?src-supplier=Digikey
IC25 IC35 IC57 = AQY221N3M: PhotoMOS Relay; Part Description: RF SON 1 Form A, PhotoMOS Relay, CxR5 (On Res. 5.5Ohm, Out Cap. 1.1pF), 25V 150mA; Manufacturer: PANASONIC; PressFit: No; Bonding: No; Part Number: AQY221N3M; Component Kind: Standard; Component Type: Standard; Device: AQY221N3M; PackageDescription: PANASONIC Serie AQY22(SON), 1.27mm Pitch; 4 Pin, 2.95mm W X 2.20mm L X 1.60mm H body; Manufacturer Part Number: AQY221N3M; Pin Count: 4; Case: SON4; Mounted: Yes; Socket: No; SMD: Yes; Sense: No; ComponentHeight: 1.4mm; HelpURL: \\cern.ch\dfs\Applications\Altium\Datasheets\AQY221N3M.pdf; ComponentLink1Description: Package Drawing; ComponentLink1URL: \\cern.ch\dfs\Applications\Altium\Datasheets\AQY22_Package-Drawing.pdf; Author: CERN DEM JLC; CreateDate: 1/18/2010; LatestRevisionDate: 12/5/2018
R63 R64 R209 = R0402_220R_1%_0.0625W_100PPM: Resistor - 1%; Part Description: General Purpose Thick Film Chip Resistor; Manufacturer: GENERIC; Manufacturer1 Part Number: 232270672201L; TC: ±100ppm/°C; PressFit: No; Part Number: R0402_220R_1%_0.0625W_100PPM; Component Kind: Standard; Component Type: Standard; Pin Count: 2; Value: 220; Status: Not Recommended; Power: 0.0625W; Manufacturer Part Number: R0402_220R_1%_0.0625W_100PPM; Case: 0402; Mounted: Yes; Sense: No; Socket: No; SMD: Yes; Manufacturer1 Example: YAGEO PHYCOMP; Manufacturer1 ComponentHeight: 0.4mm; HelpURL: \\cern.ch\dfs\Applications\Altium\Datasheets\R0402_Phycomp_RC0402.pdf; Author: CERN DEM JLC; CreateDate: 12/3/2007; LatestRevisionDate: 10/17/2012
R65 R210 = R0402_100K_1%_0.0625W_100PPM: Resistor - 1%; Part Description: General Purpose Thick Film Chip Resistor; Manufacturer: GENERIC; Manufacturer1 Part Number: 232270671004L; TC: ±100ppm/°C; PressFit: No; Part Number: R0402_100K_1%_0.0625W_100PPM; Component Kind: Standard; Component Type: Standard; Pin Count: 2; Value: 100k; Status: Not Recommended; Power: 0.0625W; Manufacturer Part Number: R0402_100K_1%_0.0625W_100PPM; Case: 0402; Mounted: Yes; Sense: No; Socket: No; SMD: Yes; Manufacturer1 Example: YAGEO PHYCOMP; Manufacturer1 ComponentHeight: 0.4mm; HelpURL: \\cern.ch\dfs\Applications\Altium\Datasheets\R0402_Phycomp_RC0402.pdf; Author: CERN DEM JLC; CreateDate: 12/3/2007; LatestRevisionDate: 10/17/2012

## Sheet IO_Expander.SchDoc: I/O Expander
size A3; Author: M.Beldyga; CompanyName: WUT ISE; DrawnBy: M.Beldyga; Organization: WUT ISE; Address1: PW ISE; Address2: Nowowiejska 15/19 00-665 Warsaw; Address3: micbeldyga@gmail.com; SheetNumber: 6; SheetTotal: 12; ModifiedBy: -; CheckedDate: -; DivGrp: WUT ISE; Designer: M.Beldyga; ModifiedDate: -; ProjectName: Sensor Box
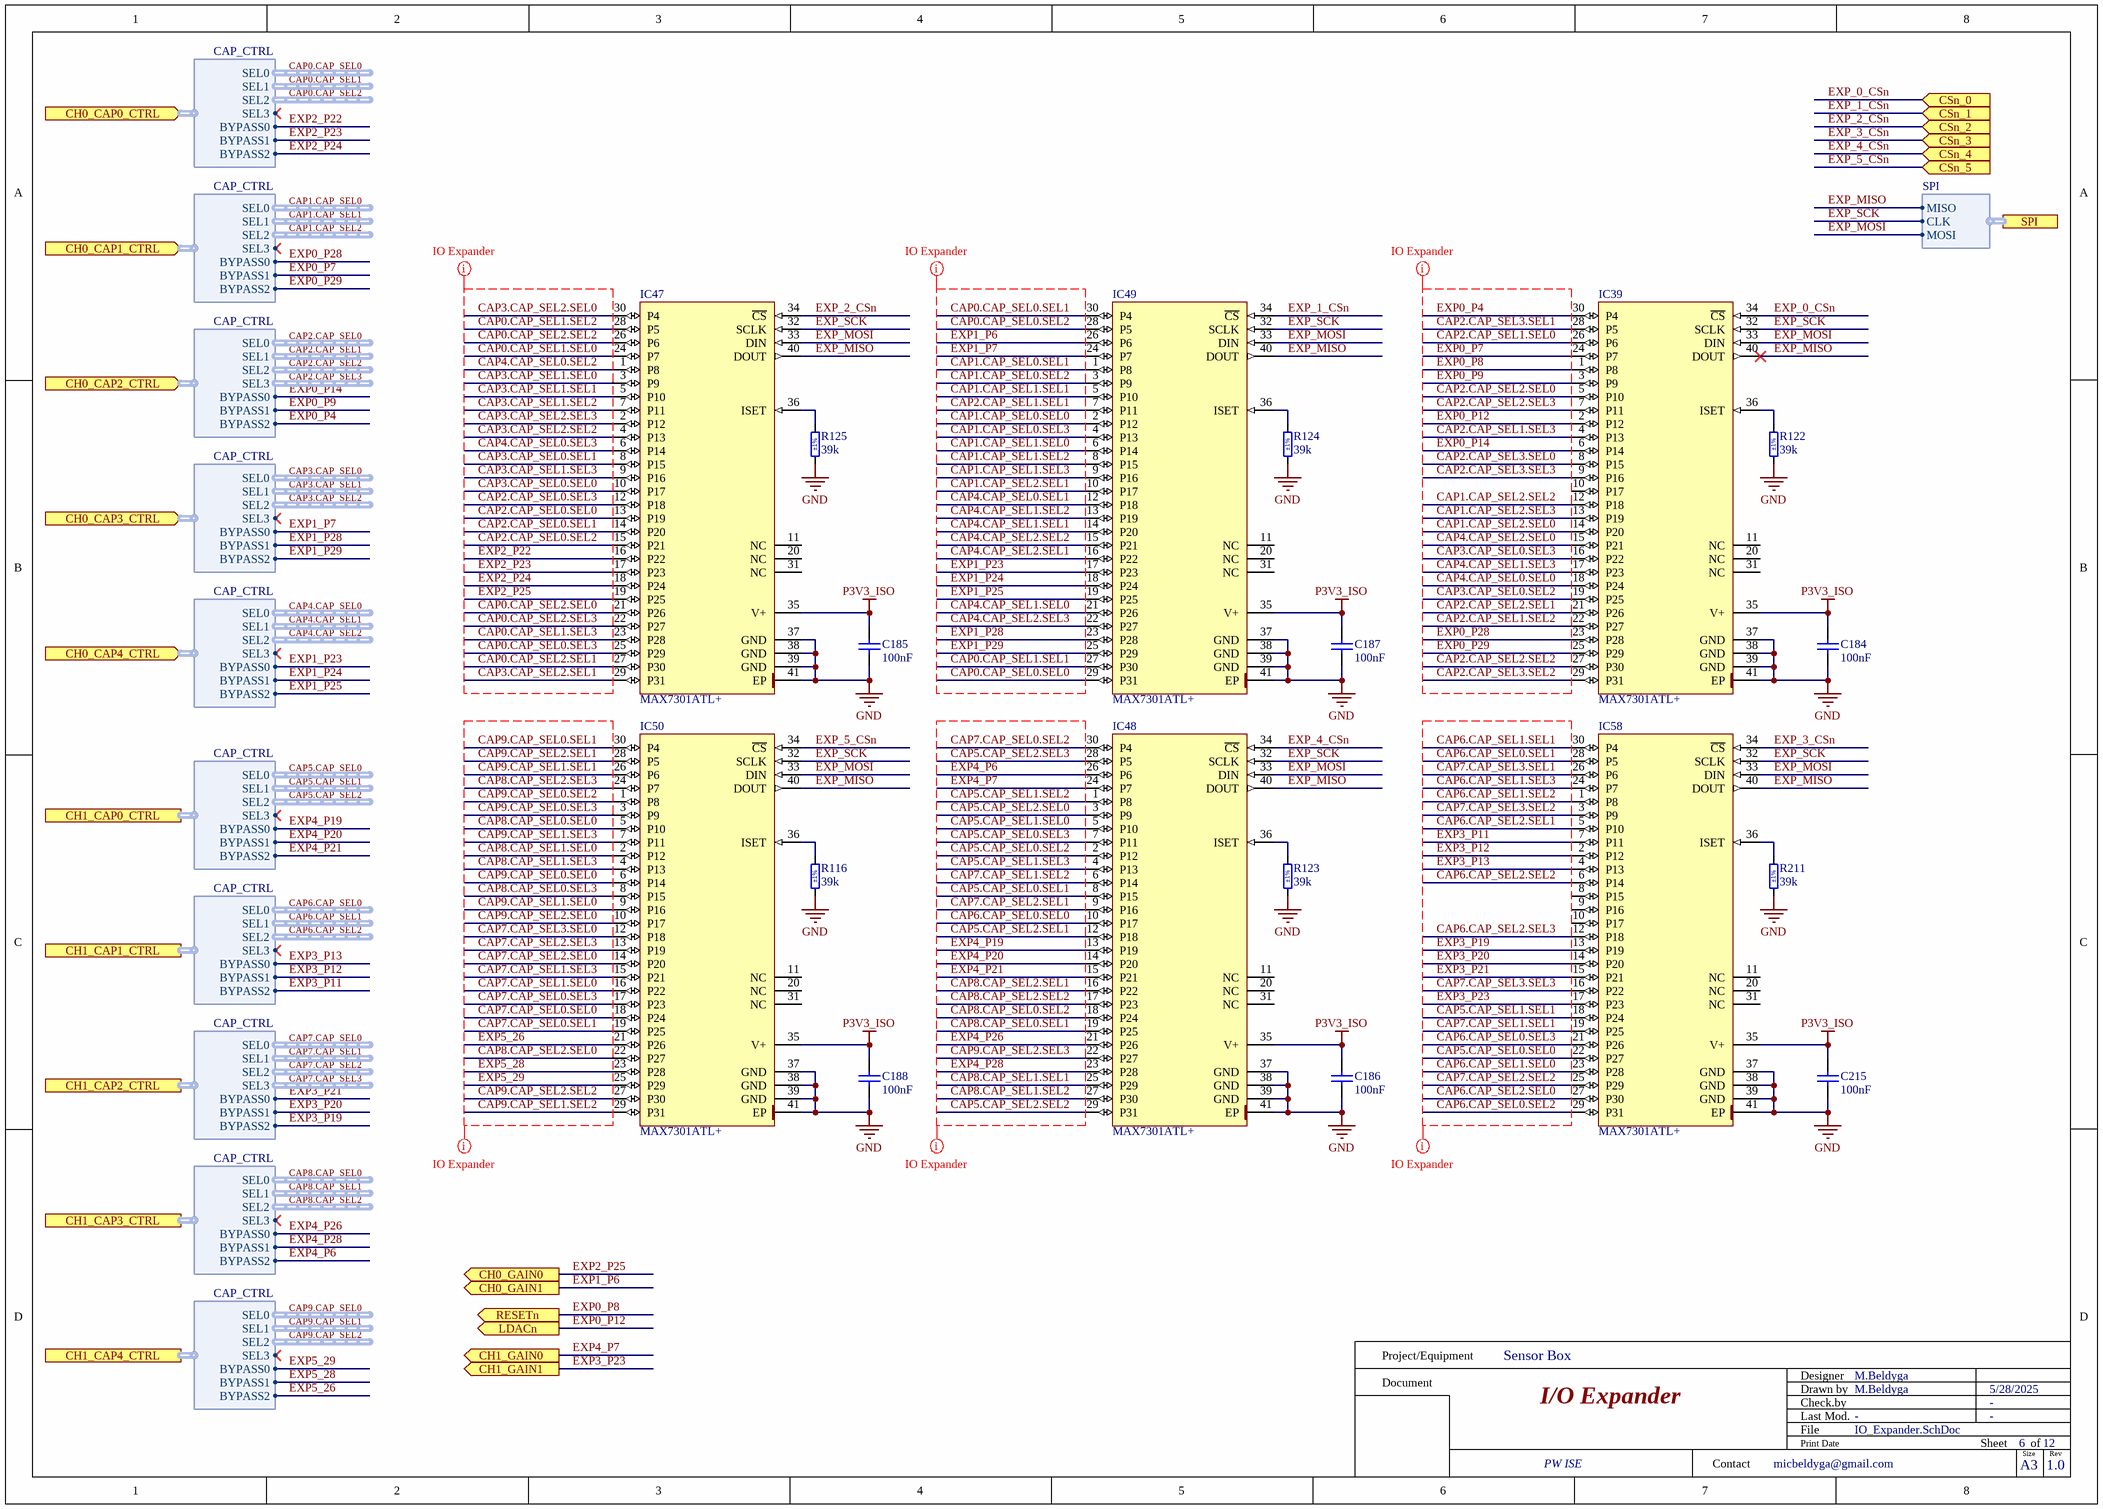
[diagram p5: IO_Expander.SchDoc]

### Parts
C184  100nF  [CAPC1005X55N]
C185  100nF  [CAPC1005X55N]
C186  100nF  [CAPC1005X55N]
C187  100nF  [CAPC1005X55N]
C188  100nF  [CAPC1005X55N]
C215  100nF  [CAPC1005X55N]
IC39  MAX7301ATL+  [QFN50P600X600X80-41N-S425]
IC47  MAX7301ATL+  [QFN50P600X600X80-41N-S425]
IC48  MAX7301ATL+  [QFN50P600X600X80-41N-S425]
IC49  MAX7301ATL+  [QFN50P600X600X80-41N-S425]
IC50  MAX7301ATL+  [QFN50P600X600X80-41N-S425]
IC58  MAX7301ATL+  [QFN50P600X600X80-41N-S425]
R116  39k  Tolerance: ±1%  [RESC1005X40N]
R122  39k  Tolerance: ±1%  [RESC1005X40N]
R123  39k  Tolerance: ±1%  [RESC1005X40N]
R124  39k  Tolerance: ±1%  [RESC1005X40N]
R125  39k  Tolerance: ±1%  [RESC1005X40N]
R211  39k  Tolerance: ±1%  [RESC1005X40N]

### Ports
CH0_CAP0_CTRL (in, harness CAP_CTRL), CH0_CAP1_CTRL (in, harness CAP_CTRL), CH0_CAP2_CTRL (in, harness CAP_CTRL), CH0_CAP3_CTRL (in, harness CAP_CTRL), CH0_CAP4_CTRL (in, harness CAP_CTRL), CH0_GAIN0 (out), CH0_GAIN1 (out), CH1_CAP0_CTRL (harness CAP_CTRL), CH1_CAP1_CTRL (harness CAP_CTRL), CH1_CAP2_CTRL (harness CAP_CTRL), CH1_CAP3_CTRL (harness CAP_CTRL), CH1_CAP4_CTRL (harness CAP_CTRL), CH1_GAIN0 (out), CH1_GAIN1 (out), CSn_0 (in), CSn_1 (in), CSn_2 (in), CSn_3 (in), CSn_4 (in), CSn_5 (in), LDACn (out), RESETn (out), SPI (harness SPI)

### Harnesses
SPI: CLK, MOSI, MISO
CAP_CTRL: BYPASS0, BYPASS1, SEL0, SEL1, SEL2, SEL3, BYPASS2

### Nets
GND: C184.1 C185.1 C186.1 C187.1 C188.1 C215.1 IC39.37(GND) IC39.38(GND) IC39.39(GND) IC39.41(EP) IC47.37(GND) IC47.38(GND) IC47.39(GND) IC47.41(EP) IC48.37(GND) IC48.38(GND) IC48.39(GND) IC48.41(EP) IC49.37(GND) IC49.38(GND) IC49.39(GND) IC49.41(EP) IC50.37(GND) IC50.38(GND) IC50.39(GND) IC50.41(EP) IC58.37(GND) IC58.38(GND) IC58.39(GND) IC58.41(EP) R116.1 R122.1 R123.1 R124.1 R125.1 R211.1
P3V3_ISO: C184.2 C185.2 C186.2 C187.2 C188.2 C215.2 IC39.35(V+) IC47.35(V+) IC48.35(V+) IC49.35(V+) IC50.35(V+) IC58.35(V+)
CAP0.CAP_SEL0.SEL0: IC49.29(P31)
CAP0.CAP_SEL0.SEL1: IC49.30(P4)
CAP0.CAP_SEL0.SEL2: IC49.28(P5)
CAP0.CAP_SEL0.SEL3: IC47.25(P29)
CAP0.CAP_SEL1.SEL0: IC47.24(P7)
CAP0.CAP_SEL1.SEL1: IC49.27(P30)
CAP0.CAP_SEL1.SEL2: IC47.28(P5)
CAP0.CAP_SEL1.SEL3: IC47.23(P28)
CAP0.CAP_SEL2.SEL0: IC47.21(P26)
CAP0.CAP_SEL2.SEL1: IC47.27(P30)
CAP0.CAP_SEL2.SEL2: IC47.26(P6)
CAP0.CAP_SEL2.SEL3: IC47.22(P27)
CAP1.CAP_SEL0.SEL0: IC49.2(P12)
CAP1.CAP_SEL0.SEL1: IC49.1(P8)
CAP1.CAP_SEL0.SEL2: IC49.3(P9)
CAP1.CAP_SEL0.SEL3: IC49.4(P13)
CAP1.CAP_SEL1.SEL0: IC49.6(P14)
CAP1.CAP_SEL1.SEL1: IC49.5(P10)
CAP1.CAP_SEL1.SEL2: IC49.8(P15)
CAP1.CAP_SEL1.SEL3: IC49.9(P16)
CAP1.CAP_SEL2.SEL0: IC39.14(P20)
CAP1.CAP_SEL2.SEL1: IC49.10(P17)
CAP1.CAP_SEL2.SEL2: IC39.12(P18)
CAP1.CAP_SEL2.SEL3: IC39.13(P19)
CAP2.CAP_SEL0.SEL0: IC47.13(P19)
CAP2.CAP_SEL0.SEL1: IC47.14(P20)
CAP2.CAP_SEL0.SEL2: IC47.15(P21)
CAP2.CAP_SEL0.SEL3: IC47.12(P18)
CAP2.CAP_SEL1.SEL0: IC39.26(P6)
CAP2.CAP_SEL1.SEL1: IC49.7(P11)
CAP2.CAP_SEL1.SEL2: IC39.22(P27)
CAP2.CAP_SEL1.SEL3: IC39.4(P13)
CAP2.CAP_SEL2.SEL0: IC39.5(P10)
CAP2.CAP_SEL2.SEL1: IC39.21(P26)
CAP2.CAP_SEL2.SEL2: IC39.27(P30)
CAP2.CAP_SEL2.SEL3: IC39.7(P11)
CAP2.CAP_SEL3.SEL0: IC39.8(P15)
CAP2.CAP_SEL3.SEL1: IC39.28(P5)
CAP2.CAP_SEL3.SEL2: IC39.29(P31)
CAP2.CAP_SEL3.SEL3: IC39.9(P16)
CAP3.CAP_SEL0.SEL0: IC47.10(P17)
CAP3.CAP_SEL0.SEL1: IC47.8(P15)
CAP3.CAP_SEL0.SEL2: IC39.19(P25)
CAP3.CAP_SEL0.SEL3: IC39.16(P22)
CAP3.CAP_SEL1.SEL0: IC47.3(P9)
CAP3.CAP_SEL1.SEL1: IC47.5(P10)
CAP3.CAP_SEL1.SEL2: IC47.7(P11)
CAP3.CAP_SEL1.SEL3: IC47.9(P16)
CAP3.CAP_SEL2.SEL0: IC47.30(P4)
CAP3.CAP_SEL2.SEL1: IC47.29(P31)
CAP3.CAP_SEL2.SEL2: IC47.4(P13)
CAP3.CAP_SEL2.SEL3: IC47.2(P12)
CAP4.CAP_SEL0.SEL0: IC39.18(P24)
CAP4.CAP_SEL0.SEL1: IC49.12(P18)
CAP4.CAP_SEL0.SEL2: IC47.1(P8)
CAP4.CAP_SEL0.SEL3: IC47.6(P14)
CAP4.CAP_SEL1.SEL0: IC49.21(P26)
CAP4.CAP_SEL1.SEL1: IC49.14(P20)
CAP4.CAP_SEL1.SEL2: IC49.13(P19)
CAP4.CAP_SEL1.SEL3: IC39.17(P23)
CAP4.CAP_SEL2.SEL0: IC39.15(P21)
CAP4.CAP_SEL2.SEL1: IC49.16(P22)
CAP4.CAP_SEL2.SEL2: IC49.15(P21)
CAP4.CAP_SEL2.SEL3: IC49.22(P27)
CAP5.CAP_SEL0.SEL0: IC58.22(P27)
CAP5.CAP_SEL0.SEL1: IC48.8(P15)
CAP5.CAP_SEL0.SEL2: IC48.2(P12)
CAP5.CAP_SEL0.SEL3: IC48.7(P11)
CAP5.CAP_SEL1.SEL0: IC48.5(P10)
CAP5.CAP_SEL1.SEL1: IC58.18(P24)
CAP5.CAP_SEL1.SEL2: IC48.1(P8)
CAP5.CAP_SEL1.SEL3: IC48.4(P13)
CAP5.CAP_SEL2.SEL0: IC48.3(P9)
CAP5.CAP_SEL2.SEL1: IC48.12(P18)
CAP5.CAP_SEL2.SEL2: IC48.29(P31)
CAP5.CAP_SEL2.SEL3: IC48.28(P5)
CAP6.CAP_SEL0.SEL0: IC48.10(P17)
CAP6.CAP_SEL0.SEL1: IC58.28(P5)
CAP6.CAP_SEL0.SEL2: IC58.29(P31)
CAP6.CAP_SEL0.SEL3: IC58.21(P26)
CAP6.CAP_SEL1.SEL0: IC58.23(P28)
CAP6.CAP_SEL1.SEL1: IC58.30(P4)
CAP6.CAP_SEL1.SEL2: IC58.1(P8)
CAP6.CAP_SEL1.SEL3: IC58.24(P7)
CAP6.CAP_SEL2.SEL0: IC58.27(P30)
CAP6.CAP_SEL2.SEL1: IC58.5(P10)
CAP6.CAP_SEL2.SEL2: IC58.6(P14)
CAP6.CAP_SEL2.SEL3: IC58.12(P18)
CAP7.CAP_SEL0.SEL0: IC50.18(P24)
CAP7.CAP_SEL0.SEL1: IC50.19(P25)
CAP7.CAP_SEL0.SEL2: IC48.30(P4)
CAP7.CAP_SEL0.SEL3: IC50.17(P23)
CAP7.CAP_SEL1.SEL0: IC50.16(P22)
CAP7.CAP_SEL1.SEL1: IC58.19(P25)
CAP7.CAP_SEL1.SEL2: IC48.6(P14)
CAP7.CAP_SEL1.SEL3: IC50.15(P21)
CAP7.CAP_SEL2.SEL0: IC50.14(P20)
CAP7.CAP_SEL2.SEL1: IC48.9(P16)
CAP7.CAP_SEL2.SEL2: IC58.25(P29)
CAP7.CAP_SEL2.SEL3: IC50.13(P19)
CAP7.CAP_SEL3.SEL0: IC50.12(P18)
CAP7.CAP_SEL3.SEL1: IC58.26(P6)
CAP7.CAP_SEL3.SEL2: IC58.3(P9)
CAP7.CAP_SEL3.SEL3: IC58.16(P22)
CAP8.CAP_SEL0.SEL0: IC50.5(P10)
CAP8.CAP_SEL0.SEL1: IC48.19(P25)
CAP8.CAP_SEL0.SEL2: IC48.18(P24)
CAP8.CAP_SEL0.SEL3: IC50.8(P15)
CAP8.CAP_SEL1.SEL0: IC50.2(P12)
CAP8.CAP_SEL1.SEL1: IC48.25(P29)
CAP8.CAP_SEL1.SEL2: IC48.27(P30)
CAP8.CAP_SEL1.SEL3: IC50.4(P13)
CAP8.CAP_SEL2.SEL0: IC50.22(P27)
CAP8.CAP_SEL2.SEL1: IC48.16(P22)
CAP8.CAP_SEL2.SEL2: IC48.17(P23)
CAP8.CAP_SEL2.SEL3: IC50.24(P7)
CAP9.CAP_SEL0.SEL0: IC50.6(P14)
CAP9.CAP_SEL0.SEL1: IC50.30(P4)
CAP9.CAP_SEL0.SEL2: IC50.1(P8)
CAP9.CAP_SEL0.SEL3: IC50.3(P9)
CAP9.CAP_SEL1.SEL0: IC50.9(P16)
CAP9.CAP_SEL1.SEL1: IC50.26(P6)
CAP9.CAP_SEL1.SEL2: IC50.29(P31)
CAP9.CAP_SEL1.SEL3: IC50.7(P11)
CAP9.CAP_SEL2.SEL0: IC50.10(P17)
CAP9.CAP_SEL2.SEL1: IC50.28(P5)
CAP9.CAP_SEL2.SEL2: IC50.27(P30)
CAP9.CAP_SEL2.SEL3: IC48.22(P27)
EXP0_P4: IC39.30(P4) ; port CH0_CAP2_CTRL.BYPASS2
EXP0_P7: IC39.24(P7) ; port CH0_CAP1_CTRL.BYPASS1
EXP0_P8: IC39.1(P8) ; port RESETn  [project net DAC_RESETn]
EXP0_P9: IC39.3(P9) ; port CH0_CAP2_CTRL.BYPASS1
EXP0_P12: IC39.2(P12) ; port LDACn  [project net DAC_LDACn]
EXP0_P14: IC39.6(P14) ; port CH0_CAP2_CTRL.BYPASS0
EXP0_P28: IC39.23(P28) ; port CH0_CAP1_CTRL.BYPASS0
EXP0_P29: IC39.25(P29) ; port CH0_CAP1_CTRL.BYPASS2
EXP1_P6: IC49.26(P6) ; port CH0_GAIN1
EXP1_P7: IC49.24(P7) ; port CH0_CAP3_CTRL.BYPASS0
EXP1_P23: IC49.17(P23) ; port CH0_CAP4_CTRL.BYPASS0
EXP1_P24: IC49.18(P24) ; port CH0_CAP4_CTRL.BYPASS1
EXP1_P25: IC49.19(P25) ; port CH0_CAP4_CTRL.BYPASS2
EXP1_P28: IC49.23(P28) ; port CH0_CAP3_CTRL.BYPASS1
EXP1_P29: IC49.25(P29) ; port CH0_CAP3_CTRL.BYPASS2
EXP2_P22: IC47.16(P22) ; port CH0_CAP0_CTRL.BYPASS0
EXP2_P23: IC47.17(P23) ; port CH0_CAP0_CTRL.BYPASS1
EXP2_P24: IC47.18(P24) ; port CH0_CAP0_CTRL.BYPASS2
EXP2_P25: IC47.19(P25) ; port CH0_GAIN0
EXP3_P11: IC58.7(P11) ; port CH1_CAP1_CTRL.BYPASS2
EXP3_P12: IC58.2(P12) ; port CH1_CAP1_CTRL.BYPASS1
EXP3_P13: IC58.4(P13) ; port CH1_CAP1_CTRL.BYPASS0
EXP3_P19: IC58.13(P19) ; port CH1_CAP2_CTRL.BYPASS2
EXP3_P20: IC58.14(P20) ; port CH1_CAP2_CTRL.BYPASS1
EXP3_P21: IC58.15(P21) ; port CH1_CAP2_CTRL.BYPASS0
EXP3_P23: IC58.17(P23) ; port CH1_GAIN1
EXP4_P6: IC48.26(P6) ; port CH1_CAP3_CTRL.BYPASS2
EXP4_P7: IC48.24(P7) ; port CH1_GAIN0
EXP4_P19: IC48.13(P19) ; port CH1_CAP0_CTRL.BYPASS0
EXP4_P20: IC48.14(P20) ; port CH1_CAP0_CTRL.BYPASS1
EXP4_P21: IC48.15(P21) ; port CH1_CAP0_CTRL.BYPASS2
EXP4_P26: IC48.21(P26) ; port CH1_CAP3_CTRL.BYPASS0
EXP4_P28: IC48.23(P28) ; port CH1_CAP3_CTRL.BYPASS1
EXP5_26: IC50.21(P26) ; port CH1_CAP4_CTRL.BYPASS2
EXP5_28: IC50.23(P28) ; port CH1_CAP4_CTRL.BYPASS1
EXP5_29: IC50.25(P29) ; port CH1_CAP4_CTRL.BYPASS0
EXP_0_CSn: IC39.34(~{CS}) ; port CSn_0  [project net CSn_EXP0]
EXP_1_CSn: IC49.34(~{CS}) ; port CSn_1  [project net CSn_EXP1]
EXP_2_CSn: IC47.34(~{CS}) ; port CSn_2  [project net CSn_EXP2]
EXP_3_CSn: IC58.34(~{CS}) ; port CSn_3  [project net CSn_EXP3]
EXP_4_CSn: IC48.34(~{CS}) ; port CSn_4  [project net CSn_EXP4]
EXP_5_CSn: IC50.34(~{CS}) ; port CSn_5  [project net CSn_EXP5]
EXP_MISO: IC39.40(DOUT) IC47.40(DOUT) IC48.40(DOUT) IC49.40(DOUT) IC50.40(DOUT) IC58.40(DOUT) ; port SPI.MISO  [project net DAC_SDO]
EXP_MOSI: IC39.33(DIN) IC47.33(DIN) IC48.33(DIN) IC49.33(DIN) IC50.33(DIN) IC58.33(DIN) ; port SPI.MOSI  [project net DAC_SDI]
EXP_SCK: IC39.32(SCLK) IC47.32(SCLK) IC48.32(SCLK) IC49.32(SCLK) IC50.32(SCLK) IC58.32(SCLK) ; port SPI.CLK  [project net DAC_SCLK]
NetIC39_36: IC39.36(ISET) R122.2
NetIC47_36: IC47.36(ISET) R125.2
NetIC48_36: IC48.36(ISET) R123.2
NetIC49_36: IC49.36(ISET) R124.2
NetIC50_36: IC50.36(ISET) R116.2
NetIC58_36: IC58.36(ISET) R211.2

Not connected (* = marked no-connect by the designer): IC39 10(P17) 11(NC) 20(NC) 31(NC); IC47 11(NC) 20(NC) 31(NC); IC48 11(NC) 20(NC) 31(NC); IC49 11(NC) 20(NC) 31(NC); IC50 11(NC) 20(NC) 31(NC); IC58 8(P15) 9(P16) 10(P17) 11(NC) 20(NC) 31(NC)

### Layout directives
net class IO_Expander; net class CH_A_ctrl: CAP5.CAP_SEL0.SEL0, CAP5.CAP_SEL0.SEL1, CAP5.CAP_SEL0.SEL2, CAP5.CAP_SEL0.SEL3, CAP5.CAP_SEL1.SEL0, CAP5.CAP_SEL1.SEL1, CAP5.CAP_SEL1.SEL2, CAP5.CAP_SEL1.SEL3, CAP5.CAP_SEL2.SEL0, CAP5.CAP_SEL2.SEL1, CAP5.CAP_SEL2.SEL2, CAP5.CAP_SEL2.SEL3, CAP6.CAP_SEL0.SEL0, CAP6.CAP_SEL0.SEL1, CAP6.CAP_SEL0.SEL2, CAP6.CAP_SEL0.SEL3, CAP6.CAP_SEL1.SEL0, CAP6.CAP_SEL1.SEL1, CAP6.CAP_SEL1.SEL2, CAP6.CAP_SEL1.SEL3, CAP6.CAP_SEL2.SEL0, CAP6.CAP_SEL2.SEL1, CAP6.CAP_SEL2.SEL2, CAP6.CAP_SEL2.SEL3, CAP7.CAP_SEL0.SEL0, CAP7.CAP_SEL0.SEL1, CAP7.CAP_SEL0.SEL2, CAP7.CAP_SEL0.SEL3, CAP7.CAP_SEL1.SEL0, CAP7.CAP_SEL1.SEL1, CAP7.CAP_SEL1.SEL2, CAP7.CAP_SEL1.SEL3, CAP7.CAP_SEL2.SEL0, CAP7.CAP_SEL2.SEL1, CAP7.CAP_SEL2.SEL2, CAP7.CAP_SEL2.SEL3, CAP7.CAP_SEL3.SEL0, CAP7.CAP_SEL3.SEL1, CAP7.CAP_SEL3.SEL2, CAP7.CAP_SEL3.SEL3, CAP8.CAP_SEL0.SEL0, CAP8.CAP_SEL0.SEL1, CAP8.CAP_SEL0.SEL2, CAP8.CAP_SEL0.SEL3, CAP8.CAP_SEL1.SEL0, CAP8.CAP_SEL1.SEL1, CAP8.CAP_SEL1.SEL2, CAP8.CAP_SEL1.SEL3, CAP8.CAP_SEL2.SEL0, CAP8.CAP_SEL2.SEL1, CAP8.CAP_SEL2.SEL2, CAP8.CAP_SEL2.SEL3, CAP9.CAP_SEL0.SEL0, CAP9.CAP_SEL0.SEL1, CAP9.CAP_SEL0.SEL2, CAP9.CAP_SEL0.SEL3, CAP9.CAP_SEL1.SEL0, CAP9.CAP_SEL1.SEL1, CAP9.CAP_SEL1.SEL2, CAP9.CAP_SEL1.SEL3, CAP9.CAP_SEL2.SEL0, CAP9.CAP_SEL2.SEL1, CAP9.CAP_SEL2.SEL2, CAP9.CAP_SEL2.SEL3, EXP3_P11, EXP3_P12, EXP3_P13, EXP3_P19, EXP3_P20, EXP3_P21, EXP3_P23, EXP4_P6, EXP4_P7, EXP4_P19, EXP4_P20, EXP4_P21, EXP4_P26, EXP4_P28, EXP5_26, EXP5_28, EXP5_29
net class IO_Expander; net class CH_B_ctrl: CAP0.CAP_SEL0.SEL0, CAP0.CAP_SEL0.SEL1, CAP0.CAP_SEL0.SEL2, CAP0.CAP_SEL0.SEL3, CAP0.CAP_SEL1.SEL0, CAP0.CAP_SEL1.SEL1, CAP0.CAP_SEL1.SEL2, CAP0.CAP_SEL1.SEL3, CAP0.CAP_SEL2.SEL0, CAP0.CAP_SEL2.SEL1, CAP0.CAP_SEL2.SEL2, CAP0.CAP_SEL2.SEL3, CAP1.CAP_SEL0.SEL0, CAP1.CAP_SEL0.SEL1, CAP1.CAP_SEL0.SEL2, CAP1.CAP_SEL0.SEL3, CAP1.CAP_SEL1.SEL0, CAP1.CAP_SEL1.SEL1, CAP1.CAP_SEL1.SEL2, CAP1.CAP_SEL1.SEL3, CAP1.CAP_SEL2.SEL0, CAP1.CAP_SEL2.SEL1, CAP1.CAP_SEL2.SEL2, CAP1.CAP_SEL2.SEL3, CAP2.CAP_SEL0.SEL0, CAP2.CAP_SEL0.SEL1, CAP2.CAP_SEL0.SEL2, CAP2.CAP_SEL0.SEL3, CAP2.CAP_SEL1.SEL0, CAP2.CAP_SEL1.SEL1, CAP2.CAP_SEL1.SEL2, CAP2.CAP_SEL1.SEL3, CAP2.CAP_SEL2.SEL0, CAP2.CAP_SEL2.SEL1, CAP2.CAP_SEL2.SEL2, CAP2.CAP_SEL2.SEL3, CAP2.CAP_SEL3.SEL0, CAP2.CAP_SEL3.SEL1, CAP2.CAP_SEL3.SEL2, CAP2.CAP_SEL3.SEL3, CAP3.CAP_SEL0.SEL0, CAP3.CAP_SEL0.SEL1, CAP3.CAP_SEL0.SEL2, CAP3.CAP_SEL0.SEL3, CAP3.CAP_SEL1.SEL0, CAP3.CAP_SEL1.SEL1, CAP3.CAP_SEL1.SEL2, CAP3.CAP_SEL1.SEL3, CAP3.CAP_SEL2.SEL0, CAP3.CAP_SEL2.SEL1, CAP3.CAP_SEL2.SEL2, CAP3.CAP_SEL2.SEL3, CAP4.CAP_SEL0.SEL0, CAP4.CAP_SEL0.SEL1, CAP4.CAP_SEL0.SEL2, CAP4.CAP_SEL0.SEL3, CAP4.CAP_SEL1.SEL0, CAP4.CAP_SEL1.SEL1, CAP4.CAP_SEL1.SEL2, CAP4.CAP_SEL1.SEL3, CAP4.CAP_SEL2.SEL0, CAP4.CAP_SEL2.SEL1, CAP4.CAP_SEL2.SEL2, CAP4.CAP_SEL2.SEL3, EXP0_P4, EXP0_P7, EXP0_P8, EXP0_P9, EXP0_P12, EXP0_P14, EXP0_P28, EXP0_P29, EXP1_P6, EXP1_P7, EXP1_P23, EXP1_P24, EXP1_P25, EXP1_P28, EXP1_P29, EXP2_P22, EXP2_P23, EXP2_P24, EXP2_P25

### Notes on the sheet
- Project/Equipment
- Document
- Designer
- Drawn by
- Check.by
- Contact
- File
- Last Mod.
- Print Date
- Sheet
- Size
- A3
- of
- Rev

### Library data of the parts
C184-C188 C215 = CC0402_100NF_50V_10%_X7R: Non-polarised capacitor; Part Description: SMD Multilayer Chip Ceramic Capacitor; Manufacturer: GENERIC; Manufacturer1 Part Number: GRM155R71H104KE14D; Voltage: 50V; TC: X7R; Tolerance: ±10%; Part Number: CC0402_100NF_50V_10%_X7R; Component Kind: Standard; Component Type: Standard; Pin Count: 2; Value: 100nF; Status: None; Manufacturer Part Number: CC0402_100NF_50V_10%_X7R; Case: 0402; Mounted: Yes; Socket: No; SMD: Yes; Sense: No; Manufacturer1 Example: MURATA; Manufacturer1 ComponentHeight: 0.55mm; HelpURL: \\cern.ch\dfs\Applications\Altium\Datasheets\CC0402_MURATA_GRM155R71H104KE14D.pdf; Author: CERN DEM MR; CreateDate: 6/30/2017; LatestRevisionDate: 6/30/2017
IC39 IC47-IC50 IC58 = MAX7301ATL+: 4-Wire-Interfaced, 2.5V to 5.5V, 28-Port I/O Expander; Manufacturer: MAXIM; PressFit: No; Bonding: No; Part Number: MAX7301ATL+; Component Kind: Standard; Component Type: Standard; Device: MAX7301ATL+; PackageDescription: QFN, 0.50mm Pitch, Square; 40 Pin, 6.00mm L X 6.00mm W X 0.80mm H body (w/Thermal Tab 4.25 X 4.25mm), IPC Medium Density; Part Description: 4-Wire-Interfaced, 2.5V to 5.5V, 28-Port I/O Expander; Manufacturer Part Number: MAX7301ATL; Pin Count: 41; Case: QFN40; Mounted: Yes; Socket: No; SMD: Yes; Sense: No; ComponentHeight: 0.8mm; Author: CERN DEM BC; HelpURL: \\cern.ch\dfs\Applications\Altium\Datasheets\MAX7301ATL+.pdf; CreateDate: 5/4/2020; LatestRevisionDate: 4/4/2022
R116 R122-R125 R211 = R0402_39K_1%_0.0625W_100PPM: Resistor - 1%; Part Description: General Purpose Thick Film Chip Resistor; Manufacturer: GENERIC; Manufacturer1 Part Number: 232270673903; TC: ±100ppm/°C; PressFit: No; Part Number: R0402_39K_1%_0.0625W_100PPM; Component Kind: Standard; Component Type: Standard; Pin Count: 2; Value: 39k; Status: Not Recommended; Power: 0.0625W; Manufacturer Part Number: R0402_39K_1%_0.0625W_100PPM; Case: 0402; Mounted: Yes; Sense: No; Socket: No; SMD: Yes; Manufacturer1 Example: YAGEO PHYCOMP; Manufacturer1 ComponentHeight: 0.4mm; HelpURL: \\cern.ch\dfs\Applications\Altium\Datasheets\R0402_Phycomp_RC0402.pdf; Author: CERN DEM JLC; CreateDate: 12/3/2007; LatestRevisionDate: 10/17/2012